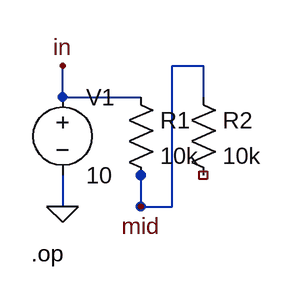
[diagram p0: schematic divider.asc]
divider.asc, the LTspice schematic file:
Version 4
SHEET 1 880 680
WIRE 128 80 208 80
WIRE 208 160 208 192
WIRE 208 192 240 192
WIRE 240 192 240 48
WIRE 240 48 272 48
WIRE 272 48 272 80
WIRE 128 80 128 48
WIRE 208 160 208 192
WIRE 128 160 128 192
FLAG 128 48 in
FLAG 208 192 mid
FLAG 128 192 0
SYMBOL voltage 128 64 R0
SYMATTR InstName V1
SYMATTR Value 10
SYMBOL res 192 64 R0
SYMATTR InstName R1
SYMATTR Value 10k
SYMBOL res 256 64 R0
SYMATTR InstName R2
SYMATTR Value 10k
TEXT 96 240 Left 2 !.op

The netlist it stands for:
* divider.asc
V1 in 0 10
R1 in mid 10k
R2 mid NC_01 10k
.op
.backanno
.end